# EAGLE design raspberryPi_sparkcore_interface (EAGLE 6.2)
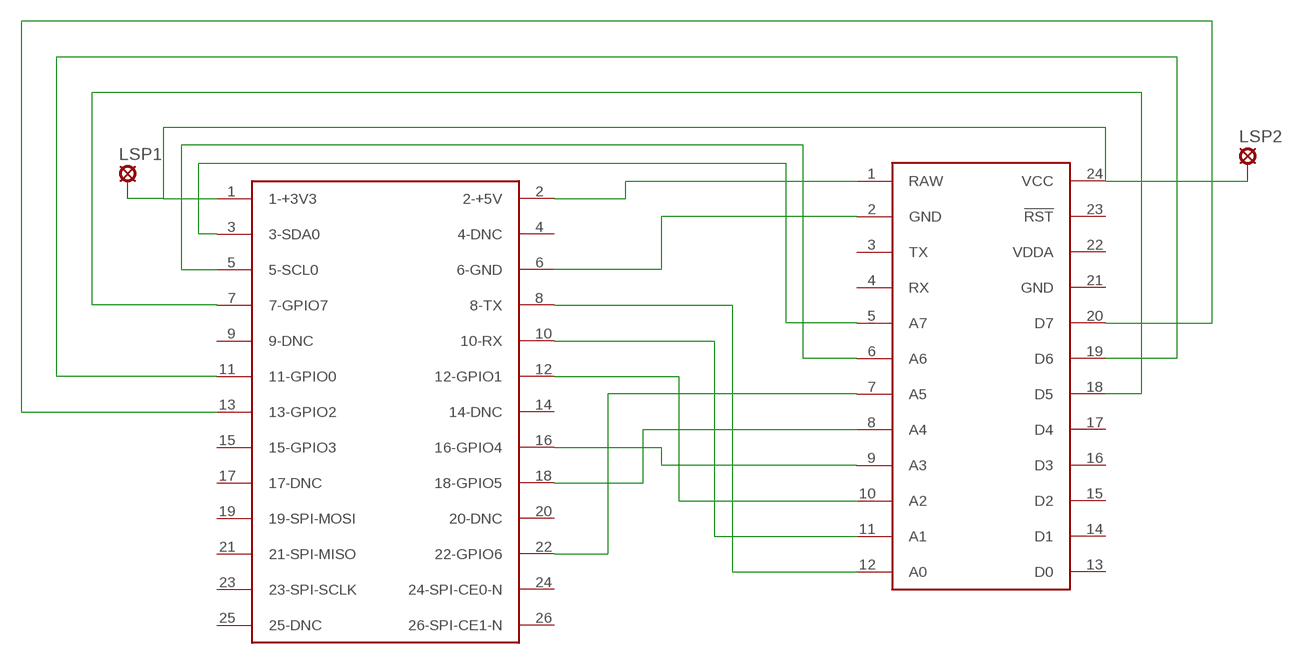
[diagram p0: schematic, sheet 1]

## Parts
LSP1  MCS08  [MCS08]
LSP2  MCS08  [MCS08]
U$1  RASPBERRY-PI  [RASPBERRY-PI]
U$2  SPARK_CORECORE  [SPARK_CORE]

## Nets
GND: U$1.6(6-GND) U$2.2(GND)
N$1: U$1.2(2-+5V) U$2.1(RAW)
N$3: LSP1.MP LSP2.MP U$1.1(1-+3V3) U$2.24(VCC)
N$4: U$1.7(7-GPIO7) U$2.18(D5)
N$5: U$1.11(11-GPIO0) U$2.19(D6)
N$6: U$1.13(13-GPIO2) U$2.20(D7)
N$7: U$1.3(3-SDA0) U$2.5(A7)
N$8: U$1.5(5-SCL0) U$2.6(A6)
N$9: U$1.8(8-TX) U$2.12(A0)
N$10: U$1.10(10-RX) U$2.11(A1)
N$11: U$1.12(12-GPIO1) U$2.10(A2)
N$12: U$1.16(16-GPIO4) U$2.9(A3)
N$13: U$1.18(18-GPIO5) U$2.8(A4)
N$14: U$1.22(22-GPIO6) U$2.7(A5)
Unconnected: U$1.4(4-DNC) U$1.9(9-DNC) U$1.14(14-DNC) U$1.15(15-GPIO3) U$1.17(17-DNC) U$1.19(19-SPI-MOSI) U$1.20(20-DNC) U$1.21(21-SPI-MISO) U$1.23(23-SPI-SCLK) U$1.24(24-SPI-CE0-N) U$1.25(25-DNC) U$1.26(26-SPI-CE1-N) U$2.3(TX) U$2.4(RX) U$2.13(D0) U$2.14(D1) U$2.15(D2) U$2.16(D3) U$2.17(D4) U$2.23(!RST)

## Power pins joined to a net without a drawn wire
GND: U$2.21(GND)
VDDA: U$2.22(VDDA)

## Library data of the parts
LSP1 LSP2 = solpad:MCS08: SOLDER PAD MC S0,8, drill 1.2 mm, distributor Buerklin, 08F130
U$1 = RaspberryPi:RASPBERRY-PI: Raspberry Pi Board <http://www.raspberrypi.org/> Jacques Lagnel V1.0 (beta) 2012 Board dimension: Forum 3D model <http://www.raspberrypi.org/forum/general-discussion/mechanical-profile-3d-models?value=3d%20model&type=1&include=1&search=1&ret=all> The GPIO Connector (P1): http://elinux.org/RPi_Low-level_peripherals
U$2 = Spark:SPARK_CORE

## Board
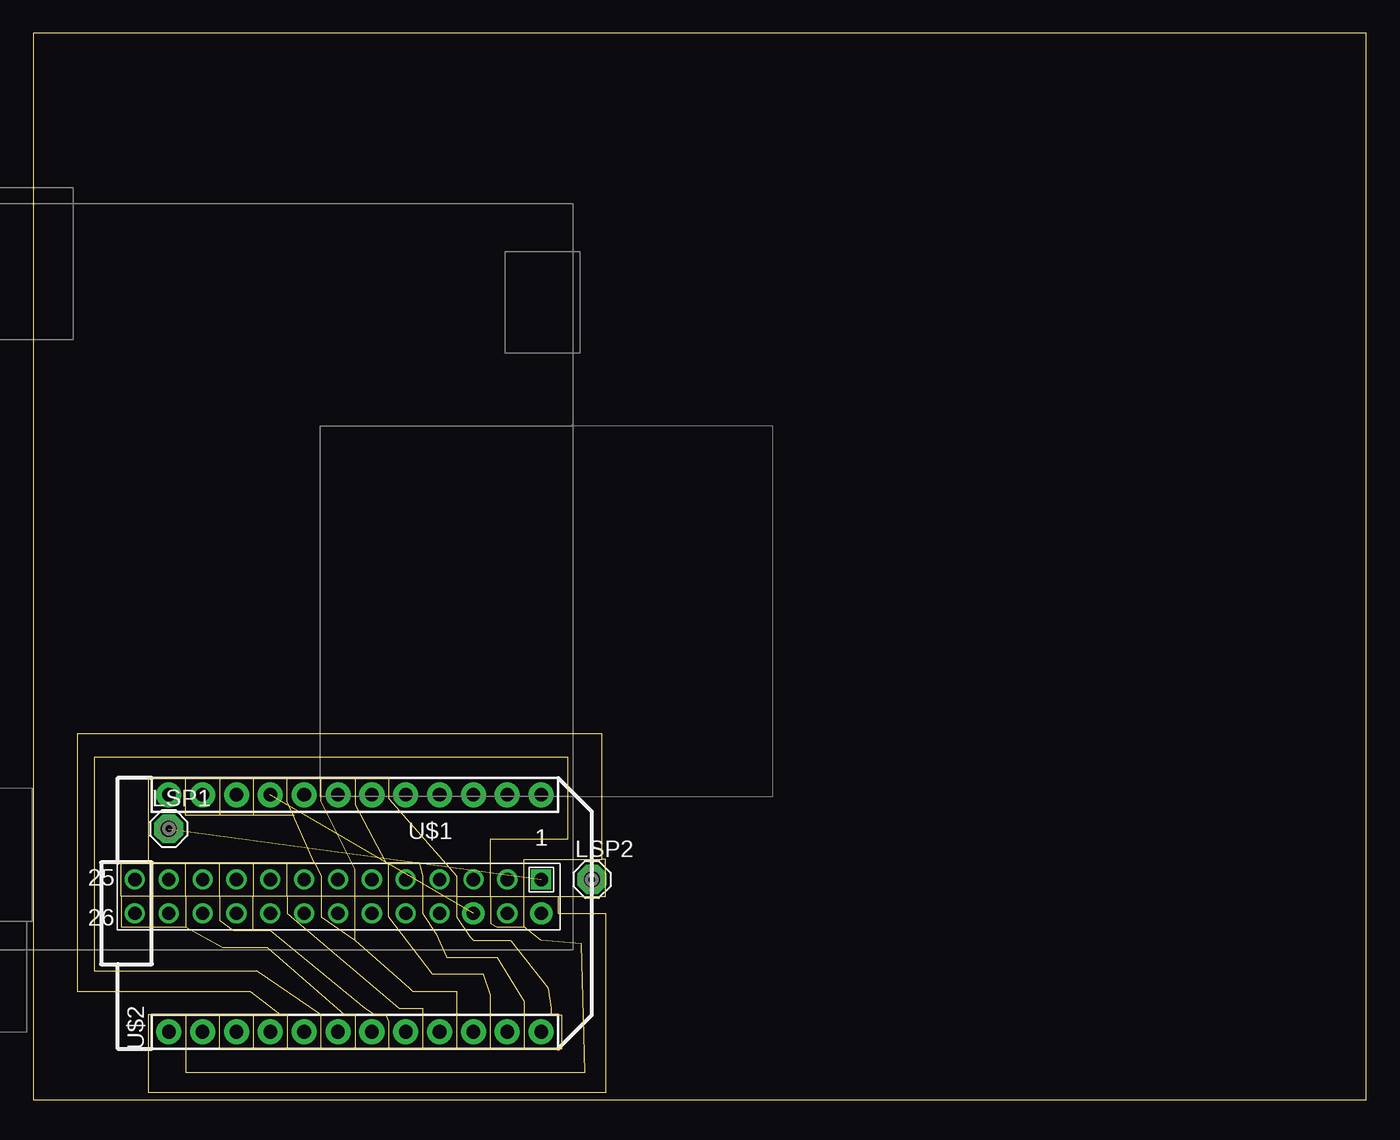
[diagram p1: board, top side]
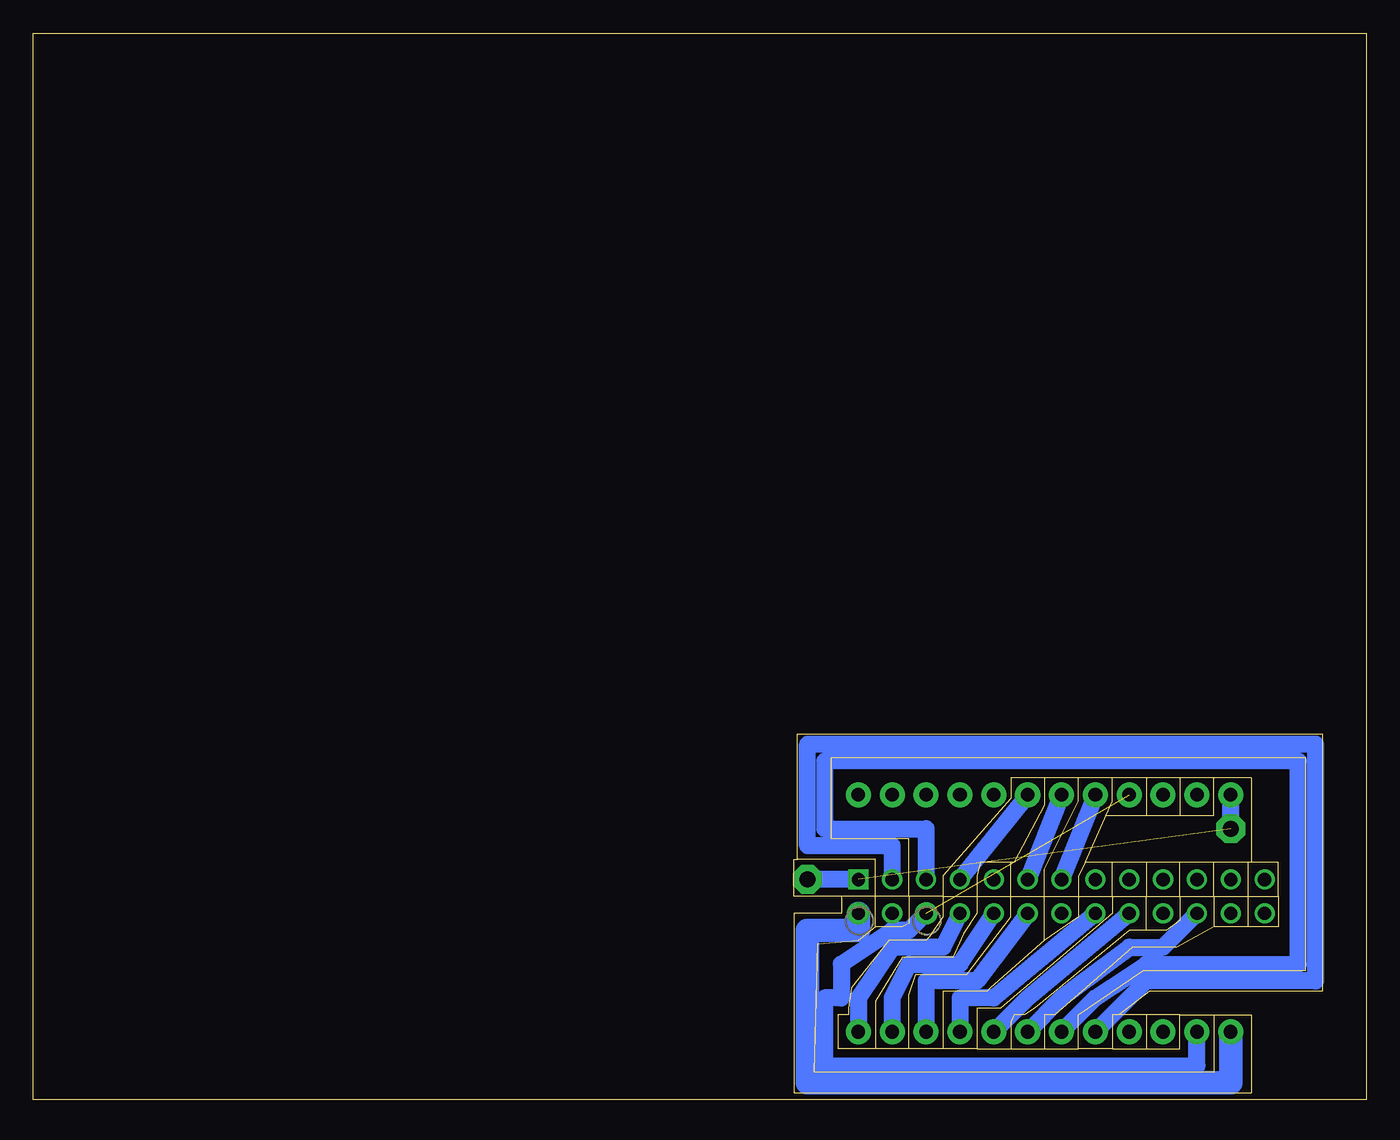
[diagram p2: board, bottom side, seen from below]

Size 100 x 80 mm. Coordinates in mm from the lower left corner, seen from the top.
Outline: 0,0 100,0 100,80 0,80 0,0
Copper layers (1*16): Top 0.035mm / dielectric 1.5mm / Bottom 0.035mm
Design rules: minimum track width 10mil, minimum drill 24mil, track to track 8mil, track to pad 8mil, pad to pad 8mil, via to via 8mil, smd to smd 8mil, copper to edge 40mil, drill to drill 8mil, minimum pad ring 10mil, minimum via ring 8mil, stop-mask expansion 4mil, vias tented up to drill 0mil, thermal gap 10mil
Milling: 155 lines

### Footprints (pad centres in the part's own frame; a part is rotated, then mirrored left to right if it is on the bottom)
MCS08 = drill 1.194 pad 2.159 octagon: MP 0,0
RASPBERRY-PI = drill 1 square: 1 0,0 | drill 1 pad 1.676: 2 0,2.54; 6 5.08,2.54 | drill 1: 3 2.54,0; 4 2.54,2.54; 5 5.08,0; 7 7.62,0; 8 7.62,2.54; 9 10.16,0; 10 10.16,2.54; 11 12.7,0; 12 12.7,2.54; 13 15.24,0; 14 15.24,2.54; 15 17.78,0; 16 17.78,2.54; 17 20.32,0; 18 20.32,2.54; 19 22.86,0; 20 22.86,2.54; 21 25.4,0; 22 25.4,2.54; 23 27.94,0; 24 27.94,2.54; 25 30.48,0; 26 30.48,2.54
SPARK_CORE = drill 1.016 pad 1.88: 1 -8.89,13.97; 2 -8.89,11.43; 3 -8.89,8.89; 4 -8.89,6.35; 5 -8.89,3.81; 6 -8.89,1.27; 7 -8.89,-1.27; 8 -8.89,-3.81; 9 -8.89,-6.35; 10 -8.89,-8.89; 11 -8.89,-11.43; 12 -8.89,-13.97; 13 8.89,-13.97; 14 8.89,-11.43; 15 8.89,-8.89; 16 8.89,-6.35; 17 8.89,-3.81; 18 8.89,-1.27; 19 8.89,1.27; 20 8.89,3.81; 21 8.89,6.35; 22 8.89,8.89; 23 8.89,11.43; 24 8.89,13.97

### Placement (x,y rotation side)
LSP1  10.16,20.32 0 top
LSP2  41.91,16.51 0 top
U$1  38.1,16.51 180 top
U$2  24.13,13.97 90 top

### Tracks (layer width: path | path; a pad name or v marks a point on that pad's centre or on a via)
GND  (1 unrouted)
  Bottom 1.27: U$1.6 34.29,12.7 35.56,12.7 39.37,10.16 39.37,7.62 40.64,7.62 40.64,2.54 12.7,2.54 U$2.2
N$1
  Bottom 1.778: U$2.1 10.16,1.27 41.91,1.27 41.91,12.7 38.1,12.7 U$1.2
N$3  (1 unrouted)
  Bottom 1.27: U$1.1 LSP2.MP | LSP1.MP U$2.24
N$4
  Bottom 1.27: U$2.18 U$1.7
N$5
  Bottom 1.27: U$2.19 U$1.11
N$6
  Bottom 1.27: U$2.20 U$1.13
N$7
  Bottom 1.27: U$1.3 35.56,19.05 41.91,19.05 41.91,26.67 3.81,26.67 3.81,8.89 16.51,8.89 U$2.5
N$8
  Bottom 1.27: U$2.6 20.32,7.62 16.51,10.16 5.08,10.16 5.08,25.4 40.64,25.4 40.64,20.32 33.02,20.32 U$1.5
N$9
  Bottom 1.27: U$1.8 31.75,11.43 35.56,11.43 38.1,7.62 U$2.12
N$10
  Bottom 1.27: U$2.11 35.56,7.62 34.29,10.16 30.48,10.16 U$1.10
N$11
  Bottom 1.27: U$1.12 29.21,8.89 33.02,8.89 U$2.10
N$12
  Bottom 1.27: U$1.16 27.94,7.62 30.48,7.62 U$2.9
N$13
  Bottom 1.27: U$2.8 25.4,7.62 U$1.18
N$14
  Bottom 1.27: U$2.7 22.86,7.62 17.78,11.43 15.24,11.43 U$1.22